# EAGLE design Example (EAGLE 9.6.2)
REVISION: 1.0; SCH_DESC: An Example Schematic; TEAM: Example_Team_Number
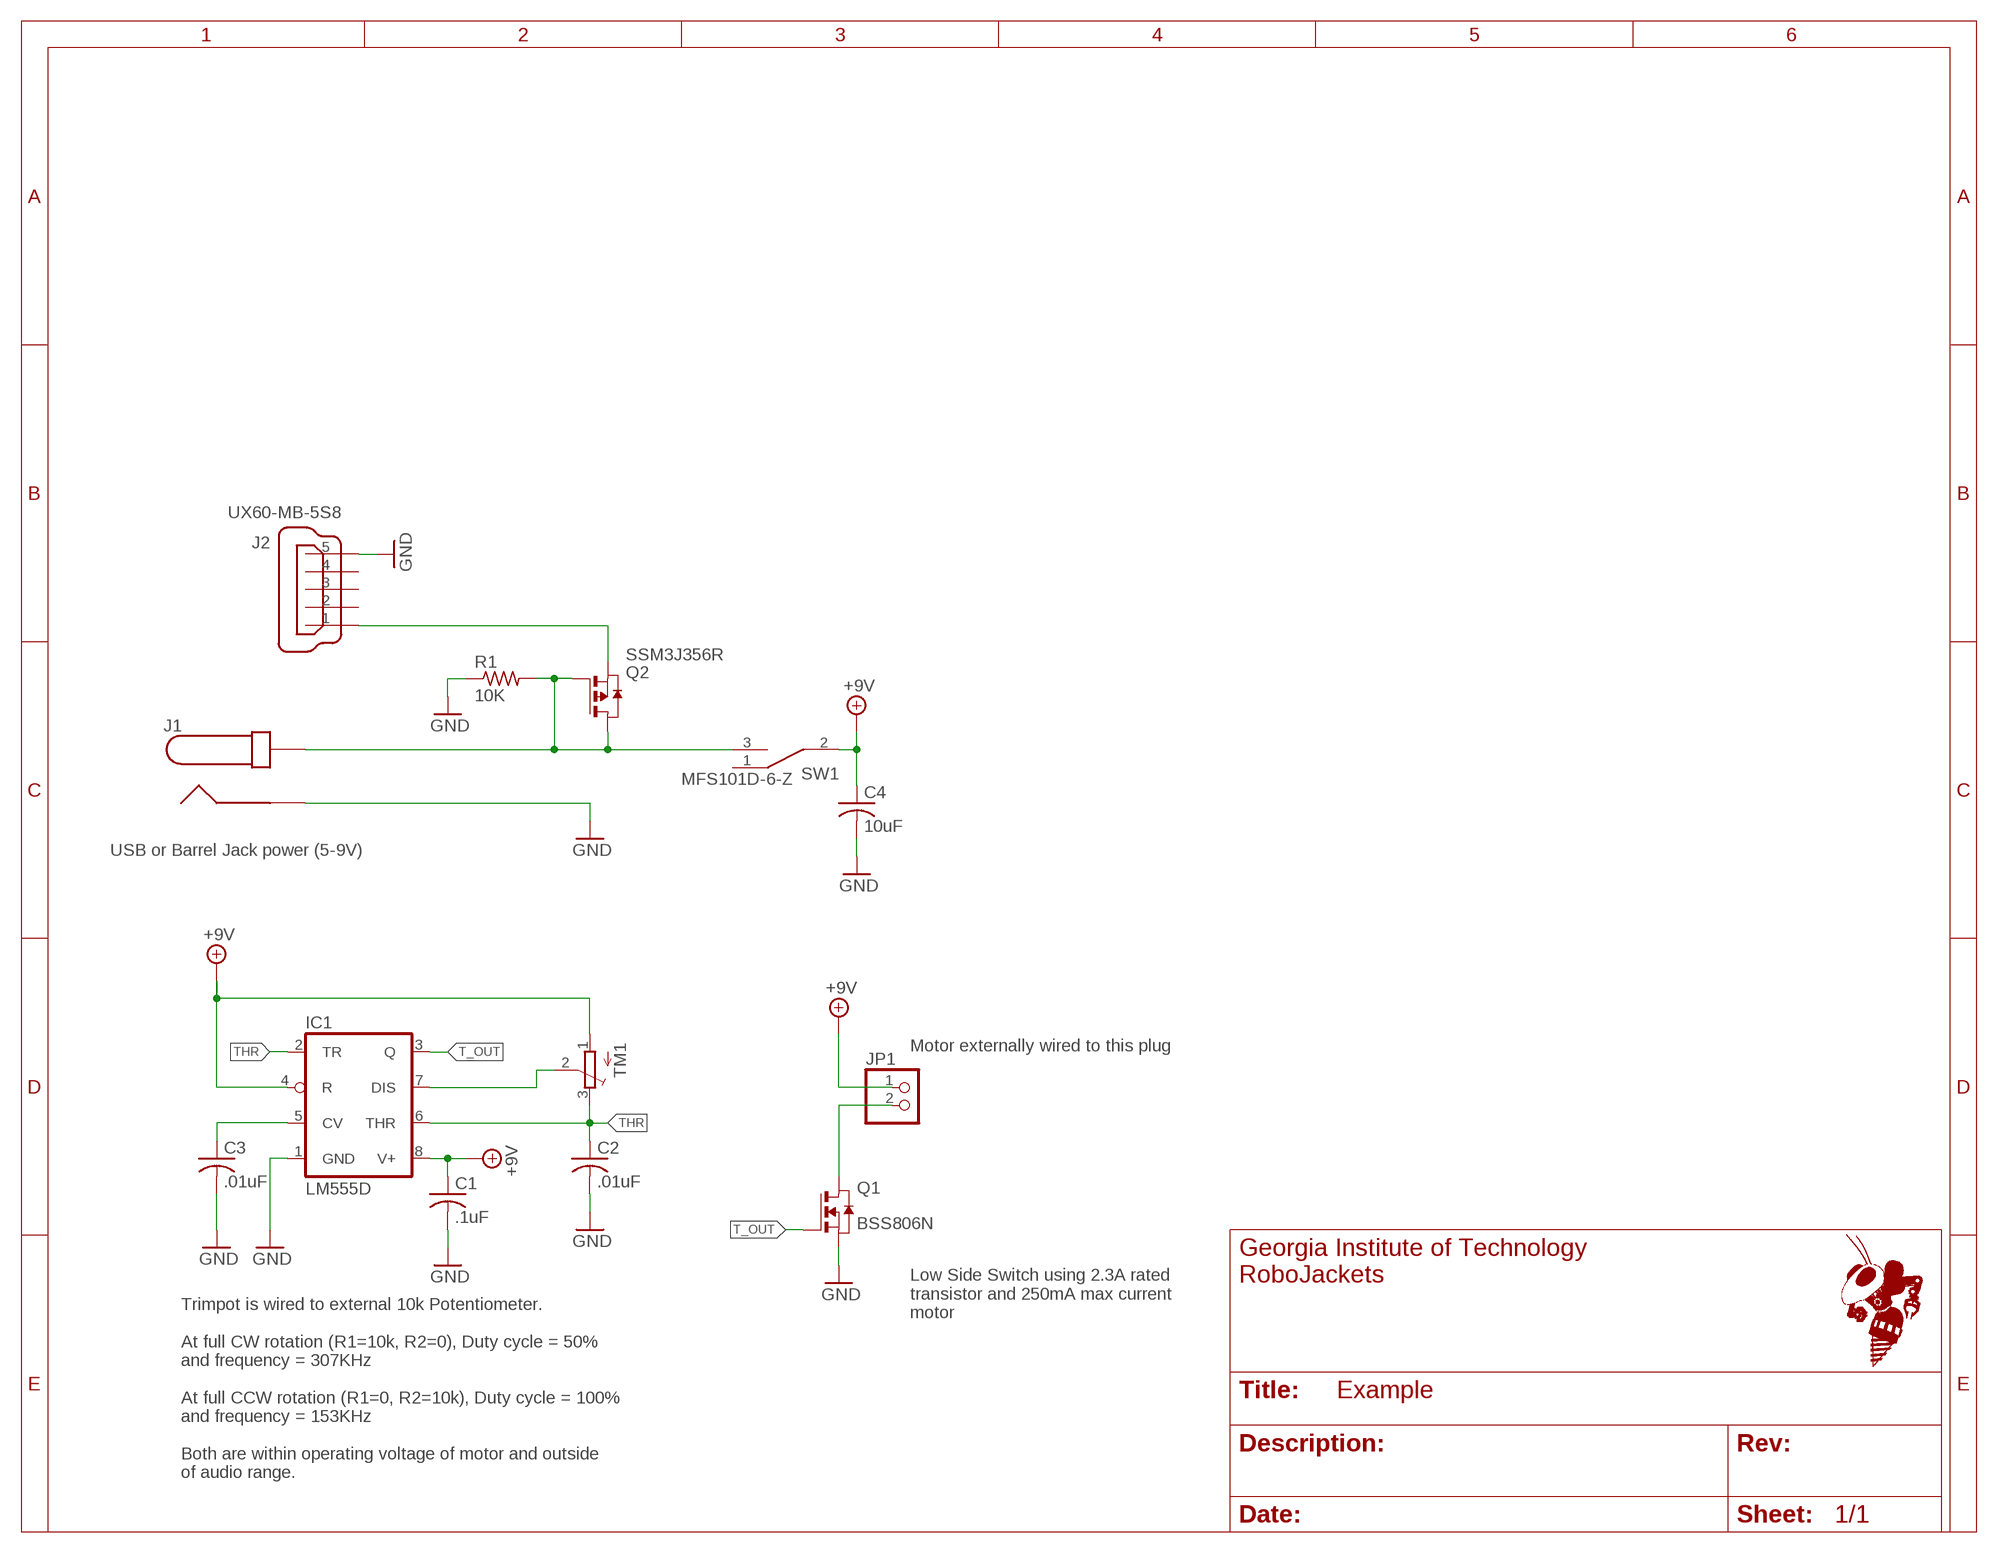
[diagram p0: schematic, sheet 1]

## Parts
C1  .1uF  C-USC0603  [C0603]
C2  .01uF  C-USC0603  [C0603]
C3  .01uF  C-USC0603  [C0603]
C4  10uF  C-USC0603  [C0603]
IC1  LM555D  [SO08]
J1  PJ-037A  [PJ-037A]
J2  UX60-MB-5S8  [UX60-MB-5S8]
JP1  PINHD-1X2  [1X02]
Q1  BSS806N  [SOT-23-3]
Q2  SSM3J356R  [SOT95P240X80-3N]
R1  10K  R-US_R0603  [R0603]
SW1  MFS101D-6-Z  [MFS101D-6-Z]
TM1  TRIMPOT3386  [TRIM-3386]

## Nets
+9V: C1.1 C4.1 IC1.4(R) IC1.8(V+) JP1.1 SW1.2(COMMON) TM1.1(A)
GND: C1.2 C2.2 C3.2 C4.2 IC1.1(GND) J1.P$1 J2.5 Q1.2(S) R1.1
N$1: IC1.7(DIS) TM1.2(S)
N$2: JP1.2 Q1.3(D)
N$3: C3.1 IC1.5(CV)
N$4: J2.1 Q2.3(S)
N$6: J1.P$2 Q2.1(G) Q2.2(D) R1.2 SW1.3(B)
T_OUT: IC1.3(Q) Q1.1(G)
THR: C2.1 IC1.2(TR) IC1.6(THR) TM1.3(E)
Unconnected: J2.2 J2.3 J2.4 SW1.1(A)

## Notes on the sheet
- USB or Barrel Jack power (5-9V)
- Motor externally wired to this plug
- Low Side Switch using 2.3A rated
  transistor and 250mA max current
  motor
- Trimpot is wired to external 10k Potentiometer.
  
  At full CW rotation (R1=10k, R2=0), Duty cycle = 50%
  and frequency = 307KHz
  
  At full CCW rotation (R1=0, R2=10k), Duty cycle = 100%
  and frequency = 153KHz
  
  Both are within operating voltage of motor and outside
  of audio range.

## Library data of the parts
C1-C4 = rcl:C-US: CAPACITOR, American symbol; SPICEPREFIX: C
IC1 = adafruit:*555: TIMER Changed DIP package to have round (not oval) pin pads http://www.ladyada.net/library/pcb/eaglelibrary.html
J1 = RoboJackets-Connectors:PJ-037A*: Description: Power Barrel Connector Jack 2.10mm ID (0.083"), 5.50mm OD (0.217") Through Hole, Right Angle Link 2.5A: Digi-Key <https://www.digikey.com/products/en?keywords=CP-037A-ND> Link 5A: Digi-Key <https://www.digikey.com/product-detail/en/cui-devices/PJ-037AH/CP-037AH-ND/1644547>; DKPN: CP-037A-ND
J2 = RoboJackets-Connectors:UX60*-MB-5S?: Description: USB - mini B USB 2.0 Receptacle Connector 5 Position, Right Angle Link SMD: Digi-Key <https://www.digikey.com/product-detail/en/hirose-electric-co-ltd/UX60A-MB-5ST/H2961CT-ND/597540> Link Through Hole: Digi-Key <https://www.digikey.com/products/en/connectors-interconnects/usb-dvi-hdmi-connectors/312?k=UX60-MB-5S8&k=&pkeyword=UX60-MB-5S8&sv=0&pv7=2&sf=0&quantity=&ColumnSort=0&page=1&pageSize=25>; DKPN: H2960CT-ND
JP1 = RoboJackets-Connectors:PINHD-1X2: PIN HEADER
Q1 = RoboJackets-Discrete:BSS806N; DKPN: BSS806NH6327XTSA1CT-ND
Q2 = Example:SSM3J356R: P-Channel 60V 2A (Ta) 1W (Ta) Surface Mount SOT-23F
R1 = rcl:R-US_: RESISTOR, American symbol; SPICEPREFIX: R
SW1 = Example:MFS101D-6-Z; DKPN: 563-1555-ND
TM1 = adafruit:TRIMPOT: SMT trimmer potentiometer part number TC33X http://www.ladyada.net/library/eagle

## Board
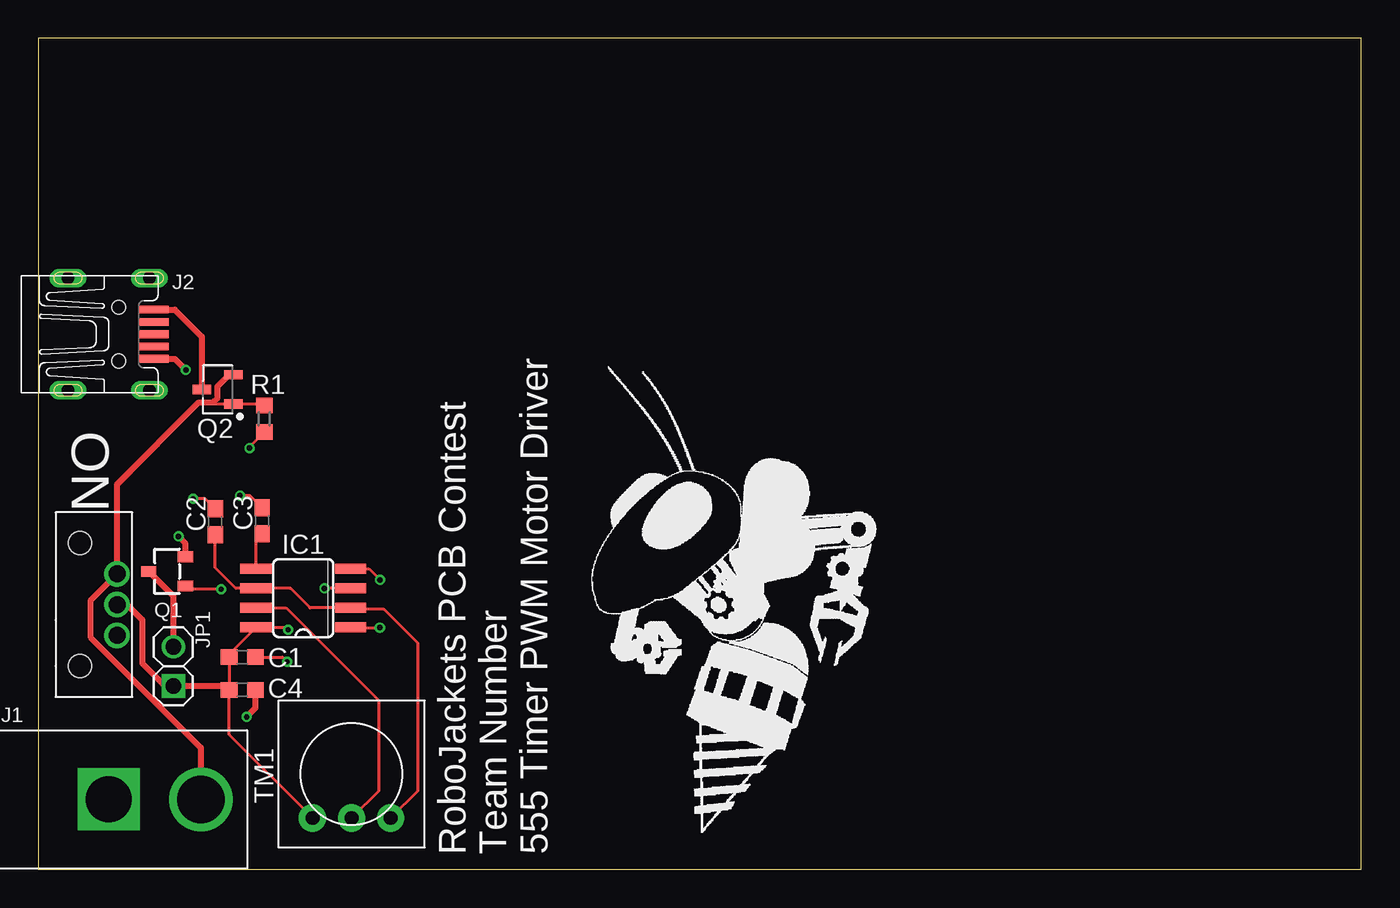
[diagram p1: board, top side]
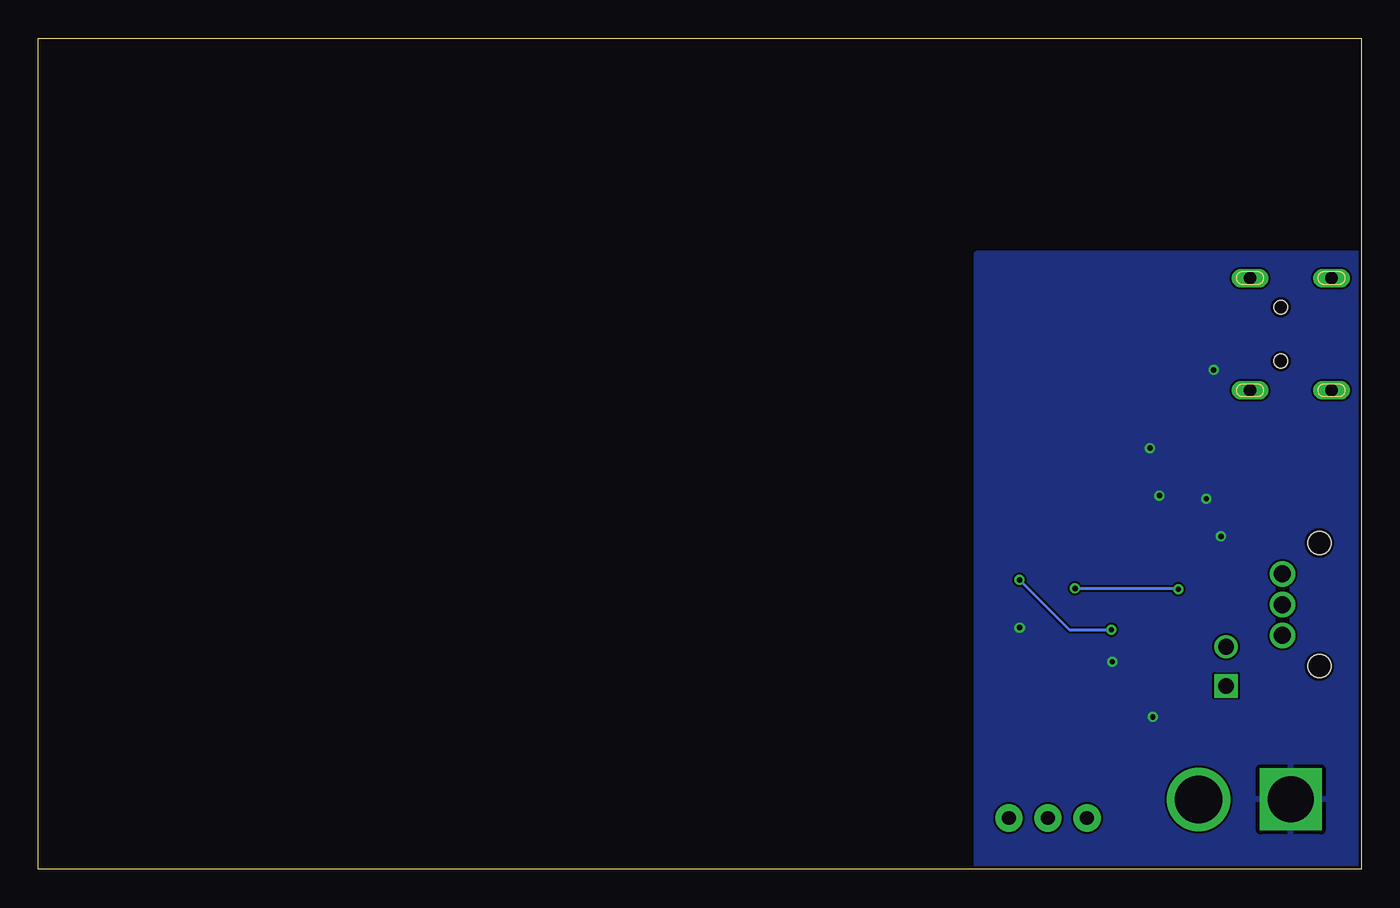
[diagram p2: board, bottom side, seen from below]

Size 86 x 54 mm. Coordinates in mm from the lower left corner, seen from the top.
Outline: 0,0 86,0 86,54 0,54 0,0
Copper layers (1+16): Top 0.035mm / dielectric 1.53mm / Bottom 0.035mm
Design rules "JLCPCB (2 Layer)": minimum track width 5mil, minimum drill 0.3mm, track to track 5mil, track to pad 5mil, pad to pad 5mil, via to via 20mil, smd to smd 5mil, copper to edge 0.2mm, drill to drill 21mil, minimum pad ring 6mil, minimum via ring 6mil, stop-mask expansion 2mil, vias tented up to drill 30mil, thermal gap 10mil

### Footprints (pad centres in the part's own frame; a part is rotated, then mirrored left to right if it is on the bottom)
C0603 = smd 1.1 x 1: 1 -0.85,0; 2 0.85,0
SO08 = smd 0.66 x 2.032: 1 -1.905,-3.073; 2 -0.635,-3.073; 3 0.635,-3.073; 4 1.905,-3.073; 5 1.905,3.073; 6 0.635,3.073; 7 -0.635,3.073; 8 -1.905,3.073
PJ-037A = drill 3 square: P$1 0,0 | drill 3.1: P$2 6,0
UX60-MB-5S8 = smd 2 x 0.5: 1 8.65,1.6; 2 8.65,0.8; 3 8.65,0; 4 8.65,-0.8; 5 8.65,-1.6 | drill 0.8 long: M1 3.1,-3.65; M2 3.1,3.65; M3 8.4,3.65; M4 8.4,-3.65 | hole 0.9: 6.4,-1.75; 6.4,1.75
1X02 = drill 1.016 square: 1 -1.27,0 | drill 1.016: 2 1.27,0
SOT-23-3 = smd 0.7 x 1: 1 -0.95,-1.2; 2 0.95,-1.2; 3 0,1.2
SOT95P240X80-3N = smd 1.18 x 0.609: 1 -1.024,0.95; 2 -1.024,-0.95; 3 1.024,0
R0603 = smd 1 x 1.1: 1 -0.85,0; 2 0.85,0
MFS101D-6-Z = drill 1.1: 1 -2,0; 2 0,0; 3 2,0 | hole 1.5: 4,2.4; -4,2.4
TRIM-3386 = drill 0.9 pad 1.778: 1 -2.54,-2.857; 2 0,-2.857; 3 2.54,-2.857

### Placement (x,y rotation side)
C1  13.26,13.78 0 top
C2  11.5,22.58 90 top
C3  14.55,22.64 90 top
C4  13.26,11.66 0 top
IC1  17.22,17.62 90 top
J1  4.56,4.54 0 top
J2  -1.18,34.78 0 top
JP1  8.77,13.19 90 top
Q1  8.37,19.36 90 top
Q2  11.65,31.19 180 top
R1  14.69,29.28 90 top
SW1  5.11,17.2 90 top
TM1  20.36,6.19 0 top
U$2  [ROBOBUZZ_1.4X]  43.06,2.36 0 top

### Tracks (layer width: path | path; a pad name or v marks a point on that pad's centre or on a via)
+9V  (via drill 0.35)
  Top 0.2: IC1.4 21.49,19.53 v22.21,18.81 | v16.24,15.57 16.11,15.7 14.17,15.7 IC1.8 12.4,13.98 | C1.1 C4.1 12.4,8.75 TM1.1
  Top 0.4: SW1.2 5.76,17.2 6.75,16.21 6.75,13.38 8.21,11.92 JP1.1 12.14,11.92 C4.1 | 12.4,13.98 C1.1
  Bottom 0.2: v22.21,18.81 18.97,15.57 v16.24,15.57
GND  (via drill 0.35)
  Top 0.2: C2.2 10.85,24.08 v10.06,24.08 | C3.2 13.75,24.29 v13.11,24.29 | IC1.1 20.31,15.7 v22.2,15.7 | C1.2 15.88,13.78 v16.17,13.49 | R1.1 13.72,27.46 v13.72,27.37
  Top 0.4: Q1.2 9.57,21.17 v9.11,21.63 | J2.5 8.86,33.18 v9.58,32.46 | C4.2 14.11,10.46 v13.54,9.9
  pour Bottom: 0,0 0,40 25,40 25,0
N$1
  Top 0.2: TM1.2 22.11,5.08 22.11,10.98 16.1,16.99 IC1.7
N$2
  Top 0.4: Q1.3 8.77,17.76 JP1.2
N$3
  Top 0.2: IC1.5 14.15,21.4 C3.1
N$4
  Top 0.4: J2.1 8.86,36.38 10.63,34.61 Q2.3
N$6
  Top 0.2: R1.2 14.58,30.24 Q2.1 11.45,30.24 11.35,30.34
  Top 0.4: J1.P$2 10.56,7.9 3.4,15.06 3.4,17.49 SW1.3 5.11,25.02 10.43,30.34 11.35,30.34 11.64,30.63 11.64,31.39 12.39,32.14 Q2.2
T_OUT  (via drill 0.35)
  Top 0.2: IC1.3 v18.6,18.26 | v11.88,18.2 9.78,18.2 Q1.1
  Bottom 0.2: v18.6,18.26 11.94,18.26 v11.88,18.2
THR
  Top 0.2: C2.1 11.5,19.59 12.83,18.26 IC1.6 16.39,18.26 17.66,16.99 IC1.2 20.35,16.93 22.44,16.93 24.65,14.72 24.65,5.08 TM1.3

### Text on the board
tPlace: ON | RoboJackets PCB Contest / Team Number / 555 Timer PWM Motor Driver